# Altium schematic sheet Constant Power Charging Board 4.5.SchDoc
size A4
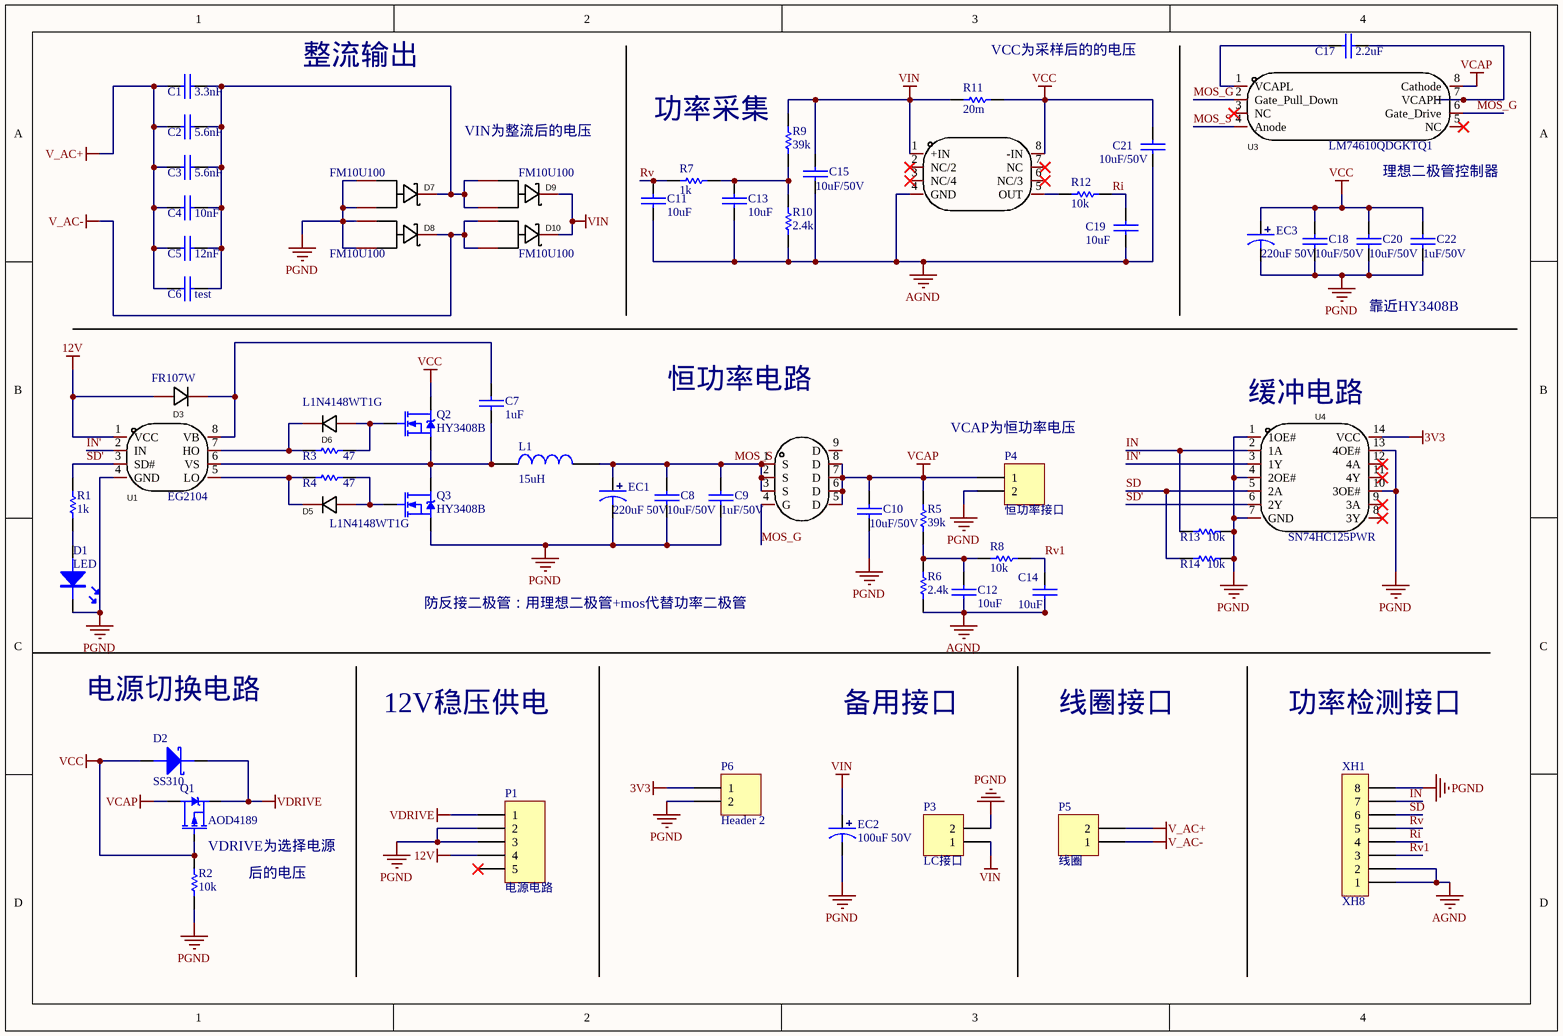
[diagram p0: Constant Power Charging Board 4.5.SchDoc]

## Parts
C1  3.3nF  [谐振电容 P=10]
C2  5.6nF  [谐振电容 P=10]
C3  5.6nF  [谐振电容 P=10]
C4  10nF  [谐振电容 P=10]
C5  12nF  [谐振电容 P=10]
C6  test  [谐振电容 P=10]
C7  1uF  [0402C]
C8  10uF/50V  [0805C]
C9  1uF/50V  [0805C]
C10  10uF/50V  [0805C]
C11  10uF  [0603C]
C12  10uF  [0603C]
C13  10uF  [0603C]
C14  10uF  [0603C]
C15  10uF/50V  [0805C]
C17  2.2uF  [0402C]
C18  10uF/50V  [0805C]
C19  10uF  [0603C]
C20  10uF/50V  [0805C]
C21  10uF/50V  [0805C]
C22  1uF/50V  [0805C]
D1  LED  [LED-0603B]
D2  SS310  [SMA/DO-214AC]
D3  FR107W  [FR107W]
D5  L1N4148WT1G  [L1N4148WT1G]
D6  L1N4148WT1G  [L1N4148WT1G]
D7  FM10U100  [FM10U100]
D8  FM10U100  [FM10U100]
D9  FM10U100  [FM10U100]
D10  FM10U100  [FM10U100]
EC1  220uF 50V  [DIP-EC1.5X4X8]
EC2  100uF 50V  [DIP-EC6.3X11]
EC3  220uF 50V  [DIP-EC1.5X4X8]
L1  15uH  [0630L]
P1  电源电路  [12V稳压电路]
P3  LC接口  [XT30U-M]
P4  恒功率接口  [XT30U-M]
P5  线圈  [线圈接口]
P6  Header 2  [HDR1X2]
Q1  AOD4189  [TO252]
Q2  HY3408B  [TO-263-2L]
Q3  HY3408B  [TO-263-2L]
Q4  TPH1R403NL_C83440  [TPH1R403NL]  (value not drawn)
R1  1k  [0402R]
R2  10k  [0402R]
R3  47  [0402R]
R4  47  [0402R]
R5  39k  [0402R]
R6  2.4k  [0402R]
R7  1k  [0402R]
R8  10k  [0402R]
R9  39k  [0402R]
R10  2.4k  [0402R]
R11  20m  [1206R]
R12  10k  [0402R]
R13  10k  [0402R]
R14  10k  [0402R]
U1  EG2104  [EG2104]
U2  AD8217BRMZ-RL  [AD8217BRMZ-RL]  (value not drawn)
U3  LM74610QDGKTQ1  [LM74610QDGKTQ1]
U4  SN74HC125PWR  [sn74hc125]
XH1  XH8  [XH8/2.54mm/180]

## Nets
3V3: P6.1 U4.14(VCC)
12V: D3.2(A) P1.4 U1.1(VCC)
AGND: C11.1 C12.1 C13.1 C14.1 C15.1 C19.1 C21.1 R6.1 R10.1 U2.4(GND) XH1.1 XH1.2
PGND: C8.1 C9.1 C10.1 C18.1 C20.1 C22.1 D1.K D7.1(A) D7.3(A) D8.1(A) D8.3(A) EC1.2 EC2.2 EC3.2 P1.2 P1.3 P3.2 P4.2 P6.2 Q3.S R2.1 R13.2 R14.2 U1.4(GND) U4.1(1OE#) U4.4(2OE#) U4.7(GND) U4.10(3OE#) U4.13(4OE#) XH1.8
V_AC+: C1.1 C2.1 C3.1 C4.1 C5.1 C6.1 P5.2
V_AC-: D8.2(C) D10.1(A) D10.3(A) P5.1
VCAP: C10.2 P4.1 Q1.D Q4.5(D) Q4.6(D) Q4.7(D) Q4.8(D) R5.2 U3.8(Cathode)
VCC: C18.2 C20.2 C21.2 C22.2 D2.A EC3.1 Q1.G Q2.D R2.2 R11.1 U2.8(-IN)
VDRIVE: D2.K P1.1 Q1.S
VIN: C15.2 D9.2(C) D10.2(C) EC2.1 P3.1 R9.2 R11.2 U2.1(+IN)
IN: R13.1 U4.2(1A) XH1.7
IN': U1.2(IN) U4.3(1Y)
MOS_G: Q4.4(G) U3.2(Gate_Pull_Down) U3.6(Gate_Drive)
MOS_S: C8.2 C9.2 EC1.1 L1.2 Q4.1(S) Q4.2(S) Q4.3(S) U3.4(Anode)
Ri: C19.2 R12.1 XH1.4
Rv: C11.2 R7.1 XH1.5
Rv1: C14.2 R8.1 XH1.3
SD: R14.1 U4.5(2A) XH1.6
SD': R1.2 U1.3(SD#) U4.6(2Y)
NetC1_2: C1.2 C2.2 C3.2 C4.2 C5.2 C6.2 D7.2(C) D9.1(A) D9.3(A)
NetC7_1: C7.1 L1.1 Q2.S Q3.D U1.6(VS)
NetC7_2: C7.2 D3.1(K) U1.8(VB)
NetC12_2: C12.2 R5.1 R6.2 R8.2
NetC13_2: C13.2 R7.2 R9.1 R10.2
NetC17_1: C17.1 U3.7(VCAPH)
NetC17_2: C17.2 U3.1(VCAPL)
NetD1_A: D1.A R1.1
NetD5_1: D5.1(K) R4.1 U1.5(LO)
NetD5_2: D5.2(A) Q3.G R4.2
NetD6_1: D6.1(K) R3.1 U1.7(HO)
NetD6_2: D6.2(A) Q2.G R3.2
NetR12_2: R12.2 U2.5(OUT)

Not connected (* = marked no-connect by the designer): P1 5*; Q4 9(D); U2 2(NC/2)* 3(NC/4)* 6(NC/3)* 7(NC)*; U3 3(NC)* 5(NC)*; U4 8(3Y)* 9(3A)* 11(4Y)* 12(4A)*

## Notes on the sheet
- 整流输出
- (near R11) VCC为采样后的的电压
- VIN为整流后的电压
- 功率采集
- 理想二极管控制器
- 靠近HY3408B
- 恒功率电路
- (near P4) VCAP为恒功率电压
- (near U4) 缓冲电路
- 防反接二极管：用理想二极管+mos代替功率二极管
- 电源切换电路
- 12V稳压供电
- 备用接口
- 线圈接口
- 功率检测接口
- VDRIVE为选择电源
- 后的电压

## Library data of the parts
C1-C15 C17-C22 = CAP: 无极性电容
D2 = DIODE SCHOTTKY: 肖特基二极管
D3 = FR107W: Manufacturer: SHIKUES(时科); Symbol: FR107W_C122857; Add into BOM: yes; Diode Configuration: 独立式; Reverse Voltage (Vr): 1kV; Average Rectified Current (Io): 1A; Forward Voltage (Vf@If): 1.3V@1A; Reverse Leakage Current: 5uA@1kV; Reverse Recovery Time (trr): 500ns; Name: FR107W; Device: FR107W_C122857; LCSC Part Name: 1kV 1A 500ns; Supplier Part: C122857; Manufacturer Part: FR107W; Supplier Footprint: SOD-123F; JLCPCB Part Class: Extended Part; Datasheet: https://atta.szlcsc.com/upload/public/pdf/source/20170721/C122857_1500622641666834601.pdf; Supplier: LCSC; Convert to PCB: yes; Operating Temperature: -55℃~+150℃@(Tj)
D5 D6 = L1N4148WT1G: Manufacturer: LRC(乐山无线电); Add into BOM: yes; Name: L1N4148WT1G; Symbol: L1N4148WT1G; Device: L1N4148WT1G; LCSC Part Name: L1N4148WT1G; Supplier Part: C78089; Manufacturer Part: L1N4148WT1G; Supplier Footprint: SOD-123; JLCPCB Part Class: Extended Part; Datasheet: https://atta.szlcsc.com/upload/public/pdf/source/20180130/C78089_15172974696991323502.pdf; Supplier: LCSC; Convert to PCB: yes
D7-D10 = FM10U100: Manufacturer: FMS(美丽微); Add into BOM: yes; Name: FM10U100; Symbol: FM10U100; Device: FM10U100; LCSC Part Name: FM10U100; Supplier Part: C376165; Manufacturer Part: FM10U100; Supplier Footprint: TO-277B; JLCPCB Part Class: Extended Part; Datasheet: https://atta.szlcsc.com/upload/public/pdf/source/20190321/C376165_EED219621ABDAFE506BD97E150B32D29.pdf; Supplier: LCSC; Convert to PCB: yes
EC1-EC3 = DIP_ECAP: 直插电解电容
L1 = INDUCTOR
P1 = Header 5: Header, 5-Pin; LatestRevisionDate: 17-Jul-2002; LatestRevisionNote: Re-released for DXP Platform.; Publisher: Altium Limited
P3-P6 = Header 2: Header, 2-Pin; LatestRevisionDate: 17-Jul-2002; LatestRevisionNote: Re-released for DXP Platform.; Publisher: Altium Limited
Q1 = P-MOS: P沟道场效应管
Q2 Q3 = N-MOS: N沟道场效应管
Q4 = TPH1R403NL: Manufacturer: TOSHIBA(东芝); Add into BOM: yes; Type: N沟道; Drain Source Voltage (Vdss): 30V; Continuous Drain Current (Id): 150A; Power Dissipation (Pd): 64W; Drain Source On Resistance (RDS(on)@Vgs,Id): 1.4mΩ@10V,30A; Gate Threshold Voltage (Vgs(th)@Id): 2.3V@500uA; Name: TPH1R403NL; Symbol: TPH1R403NL; Device: TPH1R403NL_C83440; LCSC Part Name: N沟道 30V 150A; Supplier Part: C83440; Manufacturer Part: TPH1R403NL; Supplier Footprint: DSOP-8-EP-5.0mm; JLCPCB Part Class: Extended Part; Datasheet: https://atta.szlcsc.com/upload/public/pdf/source/20170908/C83440_1504870121708958077.pdf; Supplier: LCSC; Convert to PCB: yes
R1-R14 = RES
U1 = EG2104: Manufacturer: EG(屹晶微); Add into BOM: yes; Name: EG2104; Symbol: EG2104; Device: EG2104; LCSC Part Name: EG2104; Supplier Part: C186697; Manufacturer Part: EG2104; Supplier Footprint: SOP-8-150mil; JLCPCB Part Class: Extended Part; Datasheet: https://atta.szlcsc.com/upload/public/pdf/source/20220627/4CCFA0CAB664067FEE4AF87E4129127F.pdf; Supplier: LCSC; Convert to PCB: yes
U2 = AD8217BRMZ-RL: Manufacturer: ADI(亚德诺)/LINEAR(凌特); Add into BOM: yes; Name: AD8217BRMZ-RL; Symbol: AD8217BRMZ-RL; Device: AD8217BRMZ-RL; LCSC Part Name: AD8217BRMZ-RL; Supplier Part: C652512; Manufacturer Part: AD8217BRMZ-RL; Supplier Footprint: MSOP-8; JLCPCB Part Class: Extended Part; Datasheet: https://atta.szlcsc.com/upload/public/pdf/source/20210917/AF3C106AEC076886B195CA793BFB0934.pdf; Supplier: LCSC; Convert to PCB: yes
U3 = LM74610QDGKTQ1: Manufacturer: TI(德州仪器); Add into BOM: yes; Name: LM74610QDGKTQ1; Symbol: LM74610QDGKTQ1; Device: LM74610QDGKTQ1; LCSC Part Name: LM74610QDGKTQ1; Supplier Part: C202259; Manufacturer Part: LM74610QDGKTQ1; Supplier Footprint: VSSOP-8-0.65; JLCPCB Part Class: Extended Part; Datasheet: https://atta.szlcsc.com/upload/public/pdf/source/20180404/C202259_70E4B7C153C462264F43194A5B82116A.pdf; Supplier: LCSC; Convert to PCB: yes
U4 = SN74HC125PWR: Manufacturer: TI(德州仪器); Add into BOM: yes; Logic Type: 缓冲器，非反向; Number of Elements: 4; Number of Bits per Element: 1; Output Type: 三态; Current - Output High, Low: 7.8mA、7.8mA; Voltage - Supply: 2V ~ 6V; Name: SN74HC125PWR; Symbol: SN74HC125PWR; Device: SN74HC125PWR; LCSC Part Name: SN74HC125PWR; Supplier Part: C132994; Manufacturer Part: SN74HC125PWR; Supplier Footprint: TSSOP-14; JLCPCB Part Class: Extended Part; Datasheet: https://atta.szlcsc.com/upload/public/pdf/source/20170930/C132994_1506736365150997346.pdf; Supplier: LCSC; Convert to PCB: yes; Series: 74HC; Input Type: -; Operating Temperature: -40℃~+85℃（TA）